# EasyEDA Pro project STM32功能模块V2.epro, schematic STM32功能模块V2-5V-GND互换
Board Name: STM32功能模块; Create Date: 2025-04-14; Page Name: P1; Project Name: STM32功能模块; Schematic Name: STM32功能模块; Update Date: 2025-08-05; Company: 嘉立创EDA; Page Size: A4; Version: V1.0
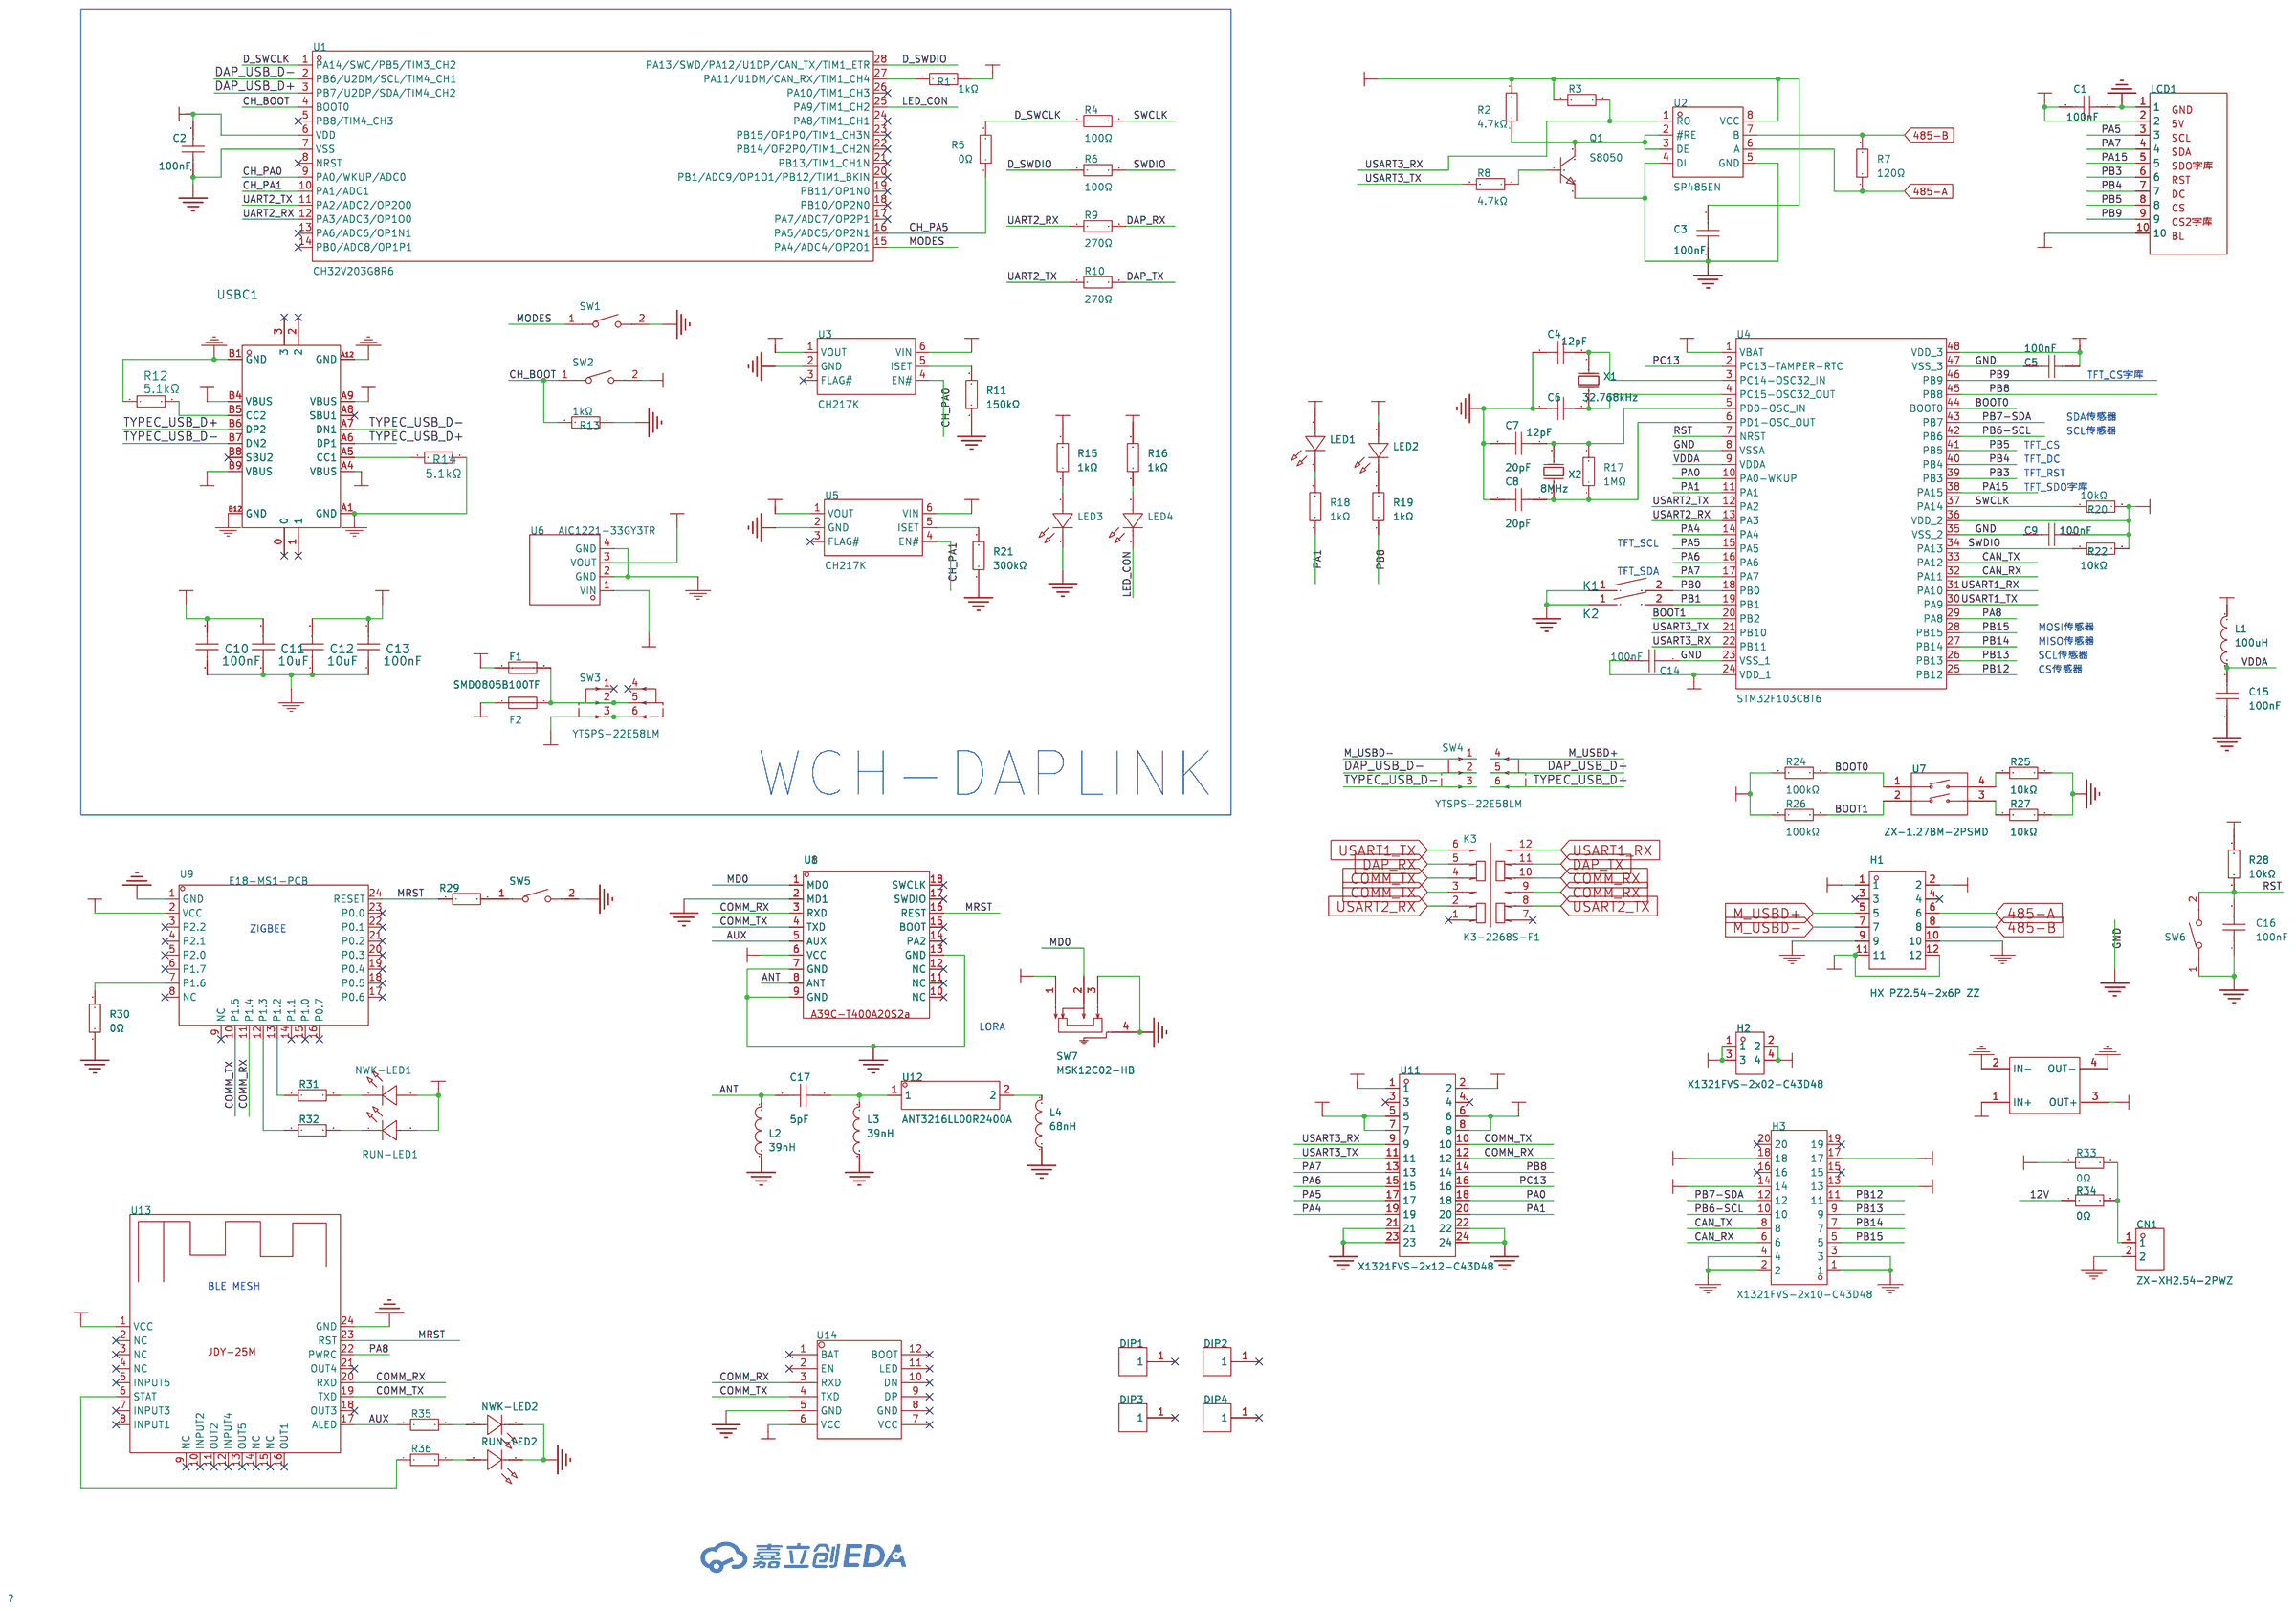
[diagram p0: schematic sheet]

## Parts
C1  100nF  [C0603]
C2  100nF  [C0603]
C3  100nF  [C0603]
C4  12pF  [C0603]
C5  100nF  [C0603]
C6  12pF  [C0603]
C7  20pF  [C0603]
C8  20pF  [C0603]
C9  100nF  [C0603]
C10  100nF  [C0603]
C11  10uF  [C0805]
C12  10uF  [C0805]
C13  100nF  [C0603]
C14  100nF  [C0603]
C15  100nF  [C0603]
C16  100nF  [C0603]
C17  5pF  [C0603]
CN1  ZX-XH2.54-2PWZ  [CONN-TH_2P-P2.50_ZX-XH2.54-2PWZ]
DIP1  -  [贴片铜柱M3*6+1]
DIP2  -  [贴片铜柱M3*6+1]
DIP3  -  [贴片铜柱M3*6+1]
DIP4  -  [贴片铜柱M3*6+1]
F1  SMD0805B100TF  [F0805]
F2  SMD0805B100TF  [F0805]
H1  HX PZ2.54-2x6P ZZ  [HDR-TH_12P-P2.54-V-M-R2-C6-S2.54_77313-101-12LF]
H2  X1321FVS-2x02-C43D48  [HDR-SMD_4P-P1.27-V-F-R2-C2-LS4.8]
H3  X1321FVS-2x10-C43D48  [HDR-SMD_20P-P1.27-V-F-R2-C10-LS4.8]
K1  TS665WS  [SW-SMD_L6.0-W6.0-LS6.6]
K2  TS665WS  [SW-SMD_L6.0-W6.0-LS6.6]
K3  5.1kΩ  [SW-TH_K3-2268S-F1]
L1  100uH  [L0805]
L2  39nH  [L0603]
L3  39nH  [L0603]
L4  68nH  [L0603]
LCD1  -  [1.54寸带字库液晶屏]
LED1  XL-1608UBC-04  [LED0603-RD_BLUE]
LED2  XL-1608UBC-04  [LED0603-RD_BLUE]
LED3  XL-1608UBC-04  [LED0603-RD_BLUE]
LED4  XL-1608UBC-04  [LED0603-RD_BLUE]
NWK-LED1  XL-1608UBC-04  [LED0603-RD_BLUE]
NWK-LED2  XL-1608UBC-04  [LED0603-RD_BLUE]
Q1  S8050  [SOT-23-3_L2.9-W1.3-P1.90-LS2.4-BR]
R1  1kΩ  [R0603]
R2  4.7kΩ  [R0603]
R3  4.7kΩ  [R0603]
R4  100Ω  [R0603]
R5  0Ω  [R0603]
R6  100Ω  [R0603]
R7  120Ω  [R1206]
R8  4.7kΩ  [R0603]
R9  270Ω  [R0603]
R10  270Ω  [R0603]
R11  150kΩ  [R0603]
R12  5.1kΩ  [R0603]
R13  1kΩ  [R0603]
R14  5.1kΩ  [R0603]
R15  1kΩ  [R0603]
R16  1kΩ  [R0603]
R17  1MΩ  [R0603]
R18  1kΩ  [R0603]
R19  1kΩ  [R0603]
R20  10kΩ  [R0603]
R21  300kΩ  [R0603]
R22  10kΩ  [R0603]
R24  100kΩ  [R0603]
R25  10kΩ  [R0603]
R26  100kΩ  [R0603]
R27  10kΩ  [R0603]
R28  10kΩ  [R0603]
R29  10kΩ  [R0603]
R30  0Ω  [R0603]
R31  1kΩ  [R0603]
R32  1kΩ  [R0603]
R33  0Ω  [R0603]
R34  0Ω  [R0603]
R35  1kΩ  [R0603]
R36  1kΩ  [R0603]
RUN-LED1  XL-1608UBC-04  [LED0603-RD_BLUE]
RUN-LED2  XL-1608UBC-04  [LED0603-RD_BLUE]
SW1  TS-1088-AR02016  [SW-SMD_L3.9-W3.0-P4.45]
SW2  TS-1088-AR02016  [SW-SMD_L3.9-W3.0-P4.45]
SW3  YTSPS-22E58LM  [SW-SMD_6P-L5.8-W5.8-P2.00-LS8.0_YTSPS-22E58LM]
SW4  YTSPS-22E58LM  [SW-SMD_6P-L5.8-W5.8-P2.00-LS8.0_YTSPS-22E58LM]
SW5  TS-1088-AR02016  [SW-SMD_L3.9-W3.0-P4.45]
SW6  TS-1088-AR02016  [SW-SMD_L3.9-W3.0-P4.45]
SW7  MSK12C02-HB  [SW-TH_MSK12C02-HB-1]
U1  CH32V203G8R6  [QSOP-28_L9.9-W3.9-P0.64-LS6.0-BL]
U2  SP485EN  [SOP-8_L5.0-W4.0-P1.27-LS6.0-BL]
U3  CH217K  [SOT-23-6_L2.9-W1.6-P0.95-LS2.8-BL]
U4  STM32F103C8T6  [LQFP-48_L7.0-W7.0-P0.50-LS9.0-BL]
U5  CH217K  [SOT-23-6_L2.9-W1.6-P0.95-LS2.8-BL]
U6  AIC1221-33GY3TR  [SOT-223_L6.5-W3.5-P2.30-LS7.0-BR]
U7  ZX-1.27BM-2PSMD  [SW-SMD_2P-L5.4-W4.1-P1.27-LS8.4]
U8  -  [Lora小模块]
U9  E18-MS1-PCB  [WIRELM-SMD_E18-MS1-PCB]
U10  -  [DC-DCmini]
U11  X1321FVS-2x12-C43D48  [HDR-SMD_24P-P1.27-V-F-R2-C12-LS4.8]
U12  ANT3216LL00R2400A  [ANT-SMD_L3.2-W1.6]
U13  -  [JDY-25M蓝牙模块]
U14  -  [度云4G模块]
USBC1  TYPE-C-31-M-12  [USB-C_SMD-TYPE-C-31-M-12]
X1  32.768kHz  [CRYSTAL-SMD_L3.2-W1.5-1]
X2  8MHz  [CRYSTAL-SMD_L5.0-W3.2]

## Library data of the parts
C1-C3 C5 C9 C10 C13-C16 = CC0603KRX7R9BB104: 容值:100nF;精度:±10%;额定电压:50V;材质(温度系数):X7R;; LCSC Part Name: 100nF ±10% 50V; Supplier Part: C14663; Manufacturer: YAGEO(国巨); Supplier Footprint: 0603; JLCPCB Part Class: 基础库; Datasheet: https://atta.szlcsc.com/upload/public/pdf/source/20180910/C282072_33301C7F631E79921B82A8DAC6BCC5B3.pdf; Supplier: LCSC; Tolerance: ±10%; Voltage Rated: 50V; Temperature Coefficient: X7R
C4 C6 = CC0603FRNPO9BN120: 容值:12pF;精度:±1%;额定电压:50V;材质(温度系数):NP0;; LCSC Part Name: 12pF ±1% 50V; Supplier Part: C519482; Manufacturer: YAGEO(国巨); Supplier Footprint: 0603; JLCPCB Part Class: 扩展库; Datasheet: https://atta.szlcsc.com/upload/public/pdf/source/20200423/C519482_89049CE53433C44DEC6365B4D6A7EBAA.pdf; Supplier: LCSC; Tolerance: ±1%; Voltage Rated: 50V; Temperature Coefficient: NP0
C7 C8 = CC0603FRNPO9BN200: 容值:20pF;精度:±1%;额定电压:50V;材质(温度系数):NP0;; LCSC Part Name: 20pF ±1% 50V; Supplier Part: C326779; Manufacturer: YAGEO(国巨); Supplier Footprint: 0603; JLCPCB Part Class: 扩展库; Datasheet: https://atta.szlcsc.com/upload/public/pdf/source/20181031/C326779_4C607DD48C96BB53EFC11FE773ED8662.pdf; Supplier: LCSC; Tolerance: ±1%; Voltage Rated: 50V; Temperature Coefficient: NP0
C11 C12 = CL21A106KAYNNNE_C15850: 容值:10uF;精度:±10%;额定电压:25V;材质(温度系数):X5R;; LCSC Part Name: 10uF ±10% 25V; Supplier Part: C15850; Manufacturer: SAMSUNG(三星); Manufacturer Part: CL21A106KAYNNNE; Supplier Footprint: 0805; JLCPCB Part Class: Basic Part; Datasheet: https://atta.szlcsc.com/upload/public/pdf/source/20160103/1457707679302.pdf; Supplier: LCSC; Tolerance: ±10%; Voltage Rated: 25V; Temperature Coefficient: X5R
C17 = CC0603BRNPO9BN5R0: 容值:5pF;额定电压:50V;材质(温度系数):NP0;; LCSC Part Name: 5pF 50V ±0.1pF; Supplier Part: C519109; Manufacturer: YAGEO(国巨); Supplier Footprint: 0603; JLCPCB Part Class: 扩展库; Datasheet: https://atta.szlcsc.com/upload/public/pdf/source/20200423/C519109_C612DEB22678B486DFBC1FD411A90853.pdf; Supplier: LCSC; Voltage Rated: 50V; Temperature Coefficient: NP0
CN1 = ZX-XH2.54-2PWZ: 插针结构:1x2P;间距:2.5mm;安装方式:弯插;参考系列:XH;总PIN数:2P;排数:1;每排PIN数:2;行距:-;额定电流:3A;触头材质:黄铜;触头镀层:锡;工作温度范围:-25℃~+85℃;; LCSC Part Name: 1x2P 间距:2.5mm 弯插 系列:XH; Supplier Part: C7429641; Manufacturer: Megastar(兆星); Supplier Footprint: 弯插,P=2.5mm; JLCPCB Part Class: 扩展库; Datasheet: https://atta.szlcsc.com/upload/public/pdf/source/20230619/56AE8F2E01CDFEAA97FC89B5ED558AB5.pdf; Supplier: LCSC; Pins Structure: 1x2P; Pitch: 2.5mm; Mounting Type: 弯插; Reference Series: XH; Number of Pins: 2P; Number of Rows: 1; Number of PINs Per Row: 2; Rated Current: 3A; Contact Material: 黄铜; Contact Plating: 锡; Operating Temperature: -25℃~+85℃; Rated Voltage (Max): 250V; Plastic Material: PA66; Flame Retardant Rating: UL94V-0; Color: 白色; Z-Height of the Board: 5.9mm; X-Length of Bottom Edge on Board (Spacing Line): 7.5mm; Y-Width of Bottom Edge on Board: 7.32mm
DIP1-DIP4 = 贴片铜柱M3*6+1
F1 F2 = SMD0805B050TF: 最大电压:6V;最大电流:100A;保持电流:500mA;跳闸电流:1A;最大动作时间:100ms;; LCSC Part Name: 6V 0.5A; Supplier Part: C269104; Manufacturer: Brightking(台湾君耀); Supplier Footprint: 0805; JLCPCB Part Class: Extended Part; Datasheet: https://atta.szlcsc.com/upload/public/pdf/source/20180814/C269104_466839A5DB65F6E723CA6A162ACE747B.pdf; Supplier: LCSC; Operating Voltage (Max): 6V; Current Rating (Max): 100A; Hold Current: 500mA; Trip Current: 1A; Maximum Time to Trip: 100ms
H1 = HX PZ2.54-2x6P ZZ: 插针结构:2x6P;间距:2.54mm;行距:2.54mm;圆针/方针:方针;安装类型:直插;排数:双排;总PIN位数:12P;额定电流:3A;额定电压:-;配合针长度:6mm;塑高:2.5mm;端接针长度:3mm;触头材质:黄铜;触头镀层:金;工作温度范围:-40℃~+105℃;颜色:黑色;; LCSC Part Name: 2x6P 间距:2.54mm 方针 直插; Supplier Part: C32713279; Manufacturer: hanxia(韩下); Supplier Footprint: 插件,P=2.54mm; JLCPCB Part Class: Extended Part; Datasheet: https://atta.szlcsc.com/upload/public/pdf/source/20240723/7CFD6BBE81D942E4FB6053E60626E655.pdf; Supplier: LCSC; Pin Structure: 2x6P; Pitch: 2.54mm; Row Spacing: 2.54mm; Circluar Pins/Square Pins: 方针; Mounting Type: 直插; Number of Rows: 双排; Number of Pins: 12P; Current Rating (Max): 3A; Length of Mating Pin: 6mm; Insulation Height: 2.5mm; Length of End Connection Pin: 3mm; Contact Material: 黄铜; Contact Plating: 金; Operating Temperature Range: -40℃~+105℃; Color: 黑色
H2 = X1321FVS-2x02-C43D48: 插孔结构:2x2P;间距:1.27mm;行距:-;圆孔/方孔:方孔;安装类型:立贴;排数:双排;总孔位数:4P;额定电流:1A;额定电压:250V;插孔方向:顶部;塑高:4.3mm;触头材质:黄铜;触头镀层:金;工作温度范围:-40℃~+105℃;焊接温度(最大值):260℃;; LCSC Part Name: 间距:1.27mm 2x2P 立贴; Supplier Part: C2684730; Manufacturer: XKB Connectivity(中国星坤); Supplier Footprint: SMD,P=1.27mm; JLCPCB Part Class: 扩展库; Datasheet: https://atta.szlcsc.com/upload/public/pdf/source/20211011/FC3020149D6BF5F353A6158A05565A46.pdf; Supplier: LCSC; Holes Structure: 2x2P; Pitch: 1.27mm; Circular Hole / Square Hole: 方孔; Mounting Type: 立贴; Number of Rows: 双排; Number of Holes: 4P; Current Rating (Max): 1A; Voltage Rating (Max): 250V; Holes Direction: 顶部; Insulation Height: 4.3mm; Contact Material: 黄铜; Contact Plating: 金; Operating Temperature Range: -40℃~+105℃; Soldering Temperature(Max): 260℃
H3 = X1321FVS-2x10-C43D48: 插孔结构:2x10P;间距:1.27mm;行距:-;圆孔/方孔:方孔;安装类型:立贴;排数:双排;总孔位数:20P;额定电流:1A;额定电压:250V;插孔方向:顶部;塑高:4.3mm;触头材质:黄铜;触头镀层:金;工作温度范围:-40℃~+105℃;焊接温度(最大值):260℃;; LCSC Part Name: 间距:1.27mm 2x10P 立贴; Supplier Part: C2684738; Manufacturer: XKB Connectivity(中国星坤); Supplier Footprint: SMD,P=1.27mm; JLCPCB Part Class: 扩展库; Datasheet: https://atta.szlcsc.com/upload/public/pdf/source/20211011/FC3020149D6BF5F353A6158A05565A46.pdf; Supplier: LCSC; Holes Structure: 2x10P; Pitch: 1.27mm; Circular Hole / Square Hole: 方孔; Mounting Type: 立贴; Number of Rows: 双排; Number of Holes: 20P; Current Rating (Max): 1A; Voltage Rating (Max): 250V; Holes Direction: 顶部; Insulation Height: 4.3mm; Contact Material: 黄铜; Contact Plating: 金; Operating Temperature Range: -40℃~+105℃; Soldering Temperature(Max): 260℃
K1 K2 = TS665WS_C398058: 触点电流:50mA;额定电压(DC):12V;电路结构:单刀单掷;安装方式:立贴;带灯:-;作用力:200gf@±50gf;机械寿命:-;; LCSC Part Name: 6*6*5mm 立贴 轻触开关 无声软胶; Supplier Part: C398058; Manufacturer: SHOU HAN(首韩); Supplier Footprint: SMD; JLCPCB Part Class: Extended Part; Datasheet: https://atta.szlcsc.com/upload/public/pdf/source/20190620/C398058_75EC11C2CCBC6DD113AE79D58CB25A40.pdf; Supplier: LCSC; Contact Current: 50mA; Voltage Rating (DC): 12V; Circuit: 单刀单掷; Mounting Style: 立贴; Actuator Style: 圆形按钮; Operating Force: 200gf@±50gf; Switch Length: 6mm; Switch Width: 6mm; Switch Height: 5mm; Insulation Resistance: 100MΩ; Actuator/Cap Color: 黑色; Operating Temperature: -25℃~+70℃; Pin Style: SMD接片; Strike Gundam: 否
K3 = K3-2268S-F1: 额定电流(DC):300mA;额定电压(DC):6V;额定电流(AC):-;额定电压(AC):-;电路结构:四刀双掷;安装方式:卧贴;机械寿命:1万次;开关颜色:黑色;; LCSC Part Name: 卧贴双档 滑动开关; Supplier Part: C223866; Manufacturer: 韩国韩荣; Supplier Footprint: SMD; JLCPCB Part Class: Extended Part; Datasheet: https://atta.szlcsc.com/upload/public/pdf/source/20210810/F3B8165E5EF761676C00BB7ABA008864.pdf; Supplier: LCSC; Current Rating (DC): 300mA; Voltage Rating (DC): 6V; Circuit: 四刀双掷; Mounting Style: 卧贴; Mechanical Life: 1万次; Actuator Color: 黑色; Actuator Style: 矩形柱状; Pin Style: 鸥翼型; Operating Temperature: -25℃~+80℃; Switch Length: 14.9mm; Switch Width: 3.5mm; Switch Height: 3.5mm; Tolerance: ±1%; Power(Watts): 100mW; Overload Voltage (Max): 75V; Temperature Coefficient: ±100ppm/℃; Type: 厚膜电阻; Operating Temperature Range: -55℃~+155℃
L1 = MLF2012C101KT000: 电感值:100uH;精度:±10%;额定电流:2mA;饱和电流(Isat):-;直流电阻(DCR):2.5Ω;; LCSC Part Name: 100uH ±10%; Supplier Part: C68035; Manufacturer: TDK; Supplier Footprint: 0805; JLCPCB Part Class: 扩展库; Datasheet: https://atta.szlcsc.com/upload/public/pdf/source/20160817/1471407089654.pdf; Supplier: LCSC; Tolerance: ±10%; Rated Current: 2mA; DC Resistance (DCR): 2.5Ω; Q @ Freq: 25@1MHz; Frequency - Self Resonant: 7MHz
L2 L3 = SDCL1608C39NJTDF: 电感值:39nH;精度:±5%;额定电流:300mA;饱和电流(Isat):-;直流电阻(DCR):700mΩ;; LCSC Part Name: 39nH ±5%; Supplier Part: C74308; Manufacturer: Sunlord(顺络); Supplier Footprint: 0603; JLCPCB Part Class: 扩展库; Datasheet: https://atta.szlcsc.com/upload/public/pdf/source/20231027/6126A3AAC5912C34388756BE22DEE00C.pdf; Supplier: LCSC; Tolerance: ±5%; Rated Current: 300mA; DC Resistance(DCR): 700mΩ; Q @ Frequency: 12@100MHz; Frequency - Self Resonant: 1.4GHz
L4 = SDCL1608C68NJTDF: 电感值:68nH;精度:±5%;额定电流:300mA;饱和电流(Isat):-;直流电阻(DCR):850mΩ;; LCSC Part Name: 68nH ±5%; Supplier Part: C13415; Manufacturer: Sunlord(顺络); Supplier Footprint: 0603; JLCPCB Part Class: 扩展库; Datasheet: https://atta.szlcsc.com/upload/public/pdf/source/20231027/6126A3AAC5912C34388756BE22DEE00C.pdf; Supplier: LCSC; Tolerance: ±5%; Rated Current: 300mA; DC Resistance(DCR): 850mΩ; Q @ Frequency: 12@100MHz; Frequency - Self Resonant: 900MHz
LCD1 = 1.54寸带字库液晶屏
LED1-LED4 = XL-1608UBC-04: 灯头类型:-;发光颜色:蓝色;正向压降(Vf):3.3V;功率:70mW;正向电流:20mA;波长:455nm~475nm;二极管配置:-;透镜颜色:无色透明透镜;色温:-;发光强度:300mcd;发光角度:120°;载带方式:正贴;工作温度:-20℃~+85℃;; Supplier Part: C965807; Manufacturer: XINGLIGHT(成兴光); Supplier Footprint: 0603; JLCPCB Part Class: 扩展库; Datasheet: https://atta.szlcsc.com/upload/public/pdf/source/20250213/9D28F40E58C3285D8CA3C7212E2FBA3B.pdf; Supplier: LCSC; Illumination Color: 蓝色; Voltage - Forward(Vf): 3.3V; Power(Watts): 70mW; Forward Current: 20mA; Wavelength - Dominant: 455nm~475nm; Peak Wavelength: 470nm; Lens Color: 无色透明透镜; Luminous Intensity: 300mcd; Viewing Angle: 120°; Mounting Sytle: 正贴; Operating Temperature: -20℃~+85℃
NWK-LED1 NWK-LED2 RUN-LED1 RUN-LED2 = XL-1608UBC-04: 灯头类型:-;发光颜色:蓝色;正向压降(Vf):3.3V;功率:70mW;正向电流:20mA;波长:455nm~475nm;二极管配置:-;透镜颜色:无色透明透镜;色温:-;发光强度:300mcd;发光角度:120°;载带方式:正贴;工作温度:-20℃~+85℃;; Supplier Part: C965807; Manufacturer: XINGLIGHT(成兴光); Supplier Footprint: 0603; JLCPCB Part Class: 扩展库; Datasheet: https://atta.szlcsc.com/upload/public/pdf/source/20250213/9D28F40E58C3285D8CA3C7212E2FBA3B.pdf; Supplier: LCSC; Illumination Color: 蓝色; Voltage - Forward(Vf): 3.3V; Power(Watts): 70mW; Forward Current: 20mA; Wavelength - Dominant: 455nm~475nm; Peak Wavelength: 470nm; Lens Color: 无色透明透镜; Luminous Intensity: 300mcd; Viewing Angle: 120°; Mounting Sytle: 正贴; Operating Temperature: -20℃~+85℃; Emitted Color: 蓝灯; Dominant Wavelength: 460nm~469nm; Power Dissipation: 80mW
Q1 = S8050_C2891804: 晶体管类型:NPN;集电极电流(Ic):500mA;集射极击穿电压(Vceo):25V;功率(Pd):300mW;直流电流增益(hFE@Ic,Vce):400@50mA,1V;; LCSC Part Name: NPN 电流:500mA 耐压:25V; Supplier Part: C2891804; Manufacturer: YONGYUTAI(永裕泰); Supplier Footprint: SOT-23; JLCPCB Part Class: 扩展库; Datasheet: https://atta.szlcsc.com/upload/public/pdf/source/20210901/5347316A10609C628D4D69AE01446E5B.pdf; Supplier: LCSC; Transistor Type: NPN; Collector Current (Ic): 500mA; Collector-Emitter Breakdown Voltage (Vceo): 25V; Power Dissipation (Pd): 300mW; DC Current Gain (hFE@Ic,Vce): 400@50mA,1V; Collector Cut-Off Current (Icbo): 1uA; Collector-Emitter Saturation Voltage (VCE(sat)@Ic,Ib): 500mV@500mA,50mA
R1 R13 R15 R16 R18 R19 R31 R32 R35 R36 = 0603WAF1001T5E: 电阻类型:厚膜电阻;阻值:1kΩ;精度:±1%;功率:100mW;最大工作电压:75V;温度系数:±100ppm/℃;; LCSC Part Name: 1kΩ ±1% 100mW 厚膜电阻; Supplier Part: C21190; Manufacturer: UNI-ROYAL(厚声); Supplier Footprint: 0603; JLCPCB Part Class: 基础库; Datasheet: https://atta.szlcsc.com/upload/public/pdf/source/20200306/C422600_1E6D84923E4A46A82E41ADD87F860B5C.pdf; Supplier: LCSC; Type: 厚膜电阻; Tolerance: ±1%; Power(Watts): 100mW; Overload Voltage (Max): 75V; Temperature Coefficient: ±100ppm/℃; Operating Temperature Range: -55℃~+155℃
R2 R3 R8 = 0603WAF4701T5E: 电阻类型:厚膜电阻;阻值:4.7kΩ;精度:±1%;功率:100mW;最大工作电压:75V;温度系数:±100ppm/℃;; LCSC Part Name: 4.7kΩ ±1% 100mW 厚膜电阻; Supplier Part: C23162; Manufacturer: UNI-ROYAL(厚声); Supplier Footprint: 0603; JLCPCB Part Class: 基础库; Datasheet: https://atta.szlcsc.com/upload/public/pdf/source/20200306/C422600_1E6D84923E4A46A82E41ADD87F860B5C.pdf; Supplier: LCSC; Type: 厚膜电阻; Tolerance: ±1%; Power(Watts): 100mW; Overload Voltage (Max): 75V; Temperature Coefficient: ±100ppm/℃; Operating Temperature Range: -55℃~+155℃
R4 R6 = 0603WAF1000T5E: 电阻类型:厚膜电阻;阻值:100Ω;精度:±1%;功率:100mW;最大工作电压:75V;温度系数:±200ppm/℃;; LCSC Part Name: 100Ω ±1% 100mW 厚膜电阻; Supplier Part: C22775; Manufacturer: UNI-ROYAL(厚声); Supplier Footprint: 0603; JLCPCB Part Class: 基础库; Datasheet: https://atta.szlcsc.com/upload/public/pdf/source/20200306/C422600_1E6D84923E4A46A82E41ADD87F860B5C.pdf; Supplier: LCSC; Type: 厚膜电阻; Tolerance: ±1%; Power(Watts): 100mW; Overload Voltage (Max): 75V; Temperature Coefficient: ±200ppm/℃; Operating Temperature Range: -55℃~+155℃
R5 R30 R33 R34 = 0603WAF0000T5E: 电阻类型:厚膜电阻;阻值:0Ω;精度:±1%;功率:100mW;最大工作电压:75V;; LCSC Part Name: 0Ω ±1% 100mW 厚膜电阻; Supplier Part: C21189; Manufacturer: UNI-ROYAL(厚声); Supplier Footprint: 0603; JLCPCB Part Class: 基础库; Datasheet: https://atta.szlcsc.com/upload/public/pdf/source/20200306/C422600_1E6D84923E4A46A82E41ADD87F860B5C.pdf; Supplier: LCSC; Type: 厚膜电阻; Tolerance: ±1%; Power(Watts): 100mW; Overload Voltage (Max): 75V; Operating Temperature Range: -55℃~+155℃
R7 = 1206W4J0121T5E: 电阻类型:厚膜电阻;阻值:120Ω;精度:±5%;功率:250mW;最大工作电压:200V;温度系数:±100ppm/℃;; LCSC Part Name: 120Ω ±5% 250mW 厚膜电阻; Supplier Part: C25351; Manufacturer: UNI-ROYAL(厚声); Supplier Footprint: 1206; JLCPCB Part Class: 扩展库; Datasheet: https://atta.szlcsc.com/upload/public/pdf/source/20200306/C422600_1E6D84923E4A46A82E41ADD87F860B5C.pdf; Supplier: LCSC; Type: 厚膜电阻; Tolerance: ±5%; Power(Watts): 250mW; Overload Voltage (Max): 200V; Temperature Coefficient: ±100ppm/℃; Operating Temperature Range: -55℃~+155℃
R9 R10 = 0603WAF2700T5E: 电阻类型:厚膜电阻;阻值:270Ω;精度:±1%;功率:100mW;最大工作电压:75V;温度系数:±100ppm/℃;; LCSC Part Name: 270Ω ±1% 100mW 厚膜电阻; Supplier Part: C22966; Manufacturer: UNI-ROYAL(厚声); Supplier Footprint: 0603; JLCPCB Part Class: 基础库; Datasheet: https://atta.szlcsc.com/upload/public/pdf/source/20200306/C422600_1E6D84923E4A46A82E41ADD87F860B5C.pdf; Supplier: LCSC; Type: 厚膜电阻; Tolerance: ±1%; Power(Watts): 100mW; Overload Voltage (Max): 75V; Temperature Coefficient: ±100ppm/℃; Operating Temperature Range: -55℃~+155℃
R11 = 0603WAF1503T5E: 电阻类型:厚膜电阻;阻值:150kΩ;精度:±1%;功率:100mW;最大工作电压:75V;温度系数:±100ppm/℃;; LCSC Part Name: 150kΩ ±1% 100mW 厚膜电阻; Supplier Part: C22807; Manufacturer: UNI-ROYAL(厚声); Supplier Footprint: 0603; JLCPCB Part Class: 基础库; Datasheet: https://atta.szlcsc.com/upload/public/pdf/source/20200306/C422600_1E6D84923E4A46A82E41ADD87F860B5C.pdf; Supplier: LCSC; Type: 厚膜电阻; Tolerance: ±1%; Power(Watts): 100mW; Overload Voltage (Max): 75V; Temperature Coefficient: ±100ppm/℃; Operating Temperature Range: -55℃~+155℃
R12 R14 = 0603WAF5101T5E: 阻值:5.1kΩ;精度:±1%;功率:100mW;温度系数:±100ppm/℃;电阻类型:厚膜电阻;; LCSC Part Name: 5.1kΩ ±1% 100mW 厚膜电阻; Supplier Part: C23186; Manufacturer: UNI-ROYAL(厚声); Supplier Footprint: 0603; JLCPCB Part Class: Basic Part; Datasheet: https://atta.szlcsc.com/upload/public/pdf/source/20200306/C422600_1E6D84923E4A46A82E41ADD87F860B5C.pdf; Supplier: LCSC; Tolerance: ±1%; Power(Watts): 100mW; Overload Voltage (Max): 75V; Temperature Coefficient: ±100ppm/℃; Type: 厚膜电阻; Operating Temperature Range: -55℃~+155℃
R17 = 0603WAF1004T5E: 电阻类型:厚膜电阻;阻值:1MΩ;精度:±1%;功率:100mW;最大工作电压:75V;温度系数:±100ppm/℃;; LCSC Part Name: 1MΩ ±1% 100mW 厚膜电阻; Supplier Part: C22935; Manufacturer: UNI-ROYAL(厚声); Supplier Footprint: 0603; JLCPCB Part Class: 基础库; Datasheet: https://atta.szlcsc.com/upload/public/pdf/source/20200306/C422600_1E6D84923E4A46A82E41ADD87F860B5C.pdf; Supplier: LCSC; Type: 厚膜电阻; Tolerance: ±1%; Power(Watts): 100mW; Overload Voltage (Max): 75V; Temperature Coefficient: ±100ppm/℃; Operating Temperature Range: -55℃~+155℃
R20 R22 R25 R27-R29 = 0603WAF1002T5E: 电阻类型:厚膜电阻;阻值:10kΩ;精度:±1%;功率:100mW;最大工作电压:75V;温度系数:±100ppm/℃;; LCSC Part Name: 厚膜电阻 10kΩ ±1% 100mW; Supplier Part: C25804; Manufacturer: UNI-ROYAL(厚声); Supplier Footprint: 0603; JLCPCB Part Class: 基础库; Datasheet: https://atta.szlcsc.com/upload/public/pdf/source/20200306/C422600_1E6D84923E4A46A82E41ADD87F860B5C.pdf; Supplier: LCSC; Type: 厚膜电阻; Tolerance: ±1%; Power(Watts): 100mW; Overload Voltage (Max): 75V; Temperature Coefficient: ±100ppm/℃; Operating Temperature Range: -55℃~+155℃
R21 = 0603WAF3003T5E: 电阻类型:厚膜电阻;阻值:300kΩ;精度:±1%;功率:100mW;最大工作电压:75V;温度系数:±100ppm/℃;; LCSC Part Name: 300kΩ ±1% 100mW 厚膜电阻; Supplier Part: C23024; Manufacturer: UNI-ROYAL(厚声); Supplier Footprint: 0603; JLCPCB Part Class: 基础库; Datasheet: https://atta.szlcsc.com/upload/public/pdf/source/20200306/C422600_1E6D84923E4A46A82E41ADD87F860B5C.pdf; Supplier: LCSC; Type: 厚膜电阻; Tolerance: ±1%; Power(Watts): 100mW; Overload Voltage (Max): 75V; Temperature Coefficient: ±100ppm/℃; Operating Temperature Range: -55℃~+155℃
R24 R26 = 0603WAF1003T5E: 电阻类型:厚膜电阻;阻值:100kΩ;精度:±1%;功率:100mW;最大工作电压:75V;温度系数:±100ppm/℃;; LCSC Part Name: 100kΩ ±1% 100mW 厚膜电阻; Supplier Part: C25803; Manufacturer: UNI-ROYAL(厚声); Supplier Footprint: 0603; JLCPCB Part Class: 基础库; Datasheet: https://atta.szlcsc.com/upload/public/pdf/source/20200306/C422600_1E6D84923E4A46A82E41ADD87F860B5C.pdf; Supplier: LCSC; Type: 厚膜电阻; Tolerance: ±1%; Power(Watts): 100mW; Overload Voltage (Max): 75V; Temperature Coefficient: ±100ppm/℃; Operating Temperature Range: -55℃~+155℃
SW1 SW2 SW5 SW6 = TS-1088-AR02016: 电路结构:单刀单掷;按钮形状:圆形按钮;作用力:160gf;安装方式:立贴;开关长度:4mm;开关宽度:3mm;开关高度:2mm;带支架:不带;触点电流:50mA;额定电压(DC):12V;绝缘电阻:100MΩ;机械寿命:10万次;; LCSC Part Name: 4*3*2mm 立贴 轻触开关; Supplier Part: C720477; Manufacturer: XUNPU(讯普); Supplier Footprint: SMD; JLCPCB Part Class: 扩展库; Datasheet: https://atta.szlcsc.com/upload/public/pdf/source/20200810/C720475_60D09DD6C54279ADDB2DC25100F1CC11.pdf; Supplier: LCSC; Circuit: 单刀单掷; Actuator Style: 圆形按钮; Operating Force: 160gf; Mounting Style: 立贴; Switch Length: 4mm; Switch Width: 3mm; Switch Height: 2mm; Strike Gundam: 不带; Contact Current: 50mA; Voltage Rating (DC): 12V; Insulation Resistance: 100MΩ; Actuator/Cap Color: 黑色; Pin Style: SMD接片; Mechanical Life: 10万次; Operating Temperature: -30℃~+80℃
SW3 SW4 = YTSPS-22E58LM: 电路结构:双刀双掷;自锁/无锁:自锁;安装方式:立贴;触点电流:500mA;额定电压 (DC):50V;作用力:1.8N;机械寿命:2万次;; LCSC Part Name: 5.8x5.8mm 贴片按键开关; Supplier Part: C2941005; Manufacturer: YIYUAN(怡远); Supplier Footprint: SMD; JLCPCB Part Class: 扩展库; Datasheet: https://atta.szlcsc.com/upload/public/pdf/source/20220105/5C885D3D6FAB3BC8492E6C715FEB9C6C.pdf; Supplier: LCSC; Circuit: 双刀双掷; Self Lock / No Lock: 自锁; Actuator Style: 方形柱塞; Mounting Style: 立贴; Contact Current: 500mA; Voltage Rating (DC): 50V; Insulation Resistance: 1000MΩ; Actuator/Cap Color: 白色; Pin Style: PC引脚; Operating Force: 1.8N; Operating Temperature: -40℃~+85℃; Mechanical Life: 2万次
SW7 = MSK12C02-HB: LCSC Part Name: 两档侧拨贴片 7脚拨动 黑柄,柄长1.5mm,带定位柱; Supplier Part: C431541; Manufacturer: SHOU HAN(首韩); Supplier Footprint: SMD; JLCPCB Part Class: Extended Part; Datasheet: https://atta.szlcsc.com/upload/public/pdf/source/20190925/C431541_43A76A06FD86AD8E3069A6BFECE3ABC5.pdf; Supplier: LCSC
U1 = CH32V203G8R6: Supplier Part: C5200779; Manufacturer: WCH(南京沁恒); Supplier Footprint: QSOP-28; JLCPCB Part Class: 扩展库; Datasheet: https://atta.szlcsc.com/upload/public/pdf/source/20230523/1B381532B53560847D0152FAE396CF1C.pdf; Supplier: LCSC
U2 = SP485EN: 类型:收发器;数据速率:2.5Mbps;驱动器/接收器:1/1;; Supplier Part: C668207; Manufacturer: UMW(友台半导体); Supplier Footprint: SOP-8; JLCPCB Part Class: 扩展库; Datasheet: https://atta.szlcsc.com/upload/public/pdf/source/20231109/64D7A7C8CFF8EB522C7335F8DA8DF010.pdf; Supplier: LCSC; Types: 收发器; Supply Voltage: 4.75V~5.25V; Data Rate: 2.5Mbps; Driver/receiver: 1/1; Operating Temperature: 0℃~+70℃
U3 U5 = CH217K: 类型:负载开关;通道数:1;输入控制逻辑:低电平有效;输出电流:2.7A;工作电压:2.7V~5.5V;导通电阻:70mΩ;; LCSC Part Name: USB 限流配电开关芯片; Supplier Part: C7462749; Manufacturer: WCH(南京沁恒); Supplier Footprint: SOT-23-6; JLCPCB Part Class: 扩展库; Datasheet: https://atta.szlcsc.com/upload/public/pdf/source/20240614/C0960F2CAA1F151A0DBC53501BDEDFC6.pdf; Supplier: LCSC; Type: 负载开关; Number of Channels: 1; Control Input Logic: 低电平有效; Output Current: 2.7A; Voltage - Supply: 2.7V~5.5V; RDS(on): 70mΩ; Operating Temperature	-: -40℃~+85℃
U4 = STM32F103C8T6: CPU内核:ARM-M3;CPU最大主频:72MHz;应用领域:-;; LCSC Part Name: 主流增强型ARM Cortex-M3 MCU，具有64 KB Flash、72 MHz CPU、电机控制、USB和CAN; Supplier Part: C8734; Manufacturer: ST(意法半导体); Supplier Footprint: LQFP-48(7x7); JLCPCB Part Class: 扩展库; Datasheet: https://atta.szlcsc.com/upload/public/pdf/source/20220812/8363ACEC51AD55ECEB84799464F7CB85.pdf; Supplier: LCSC; CPU Core: ARM-M3; CPU Maximum Speed: 72MHz; Program Storage Size: 64KB; Program Memory Type: FLASH; Number of I/O: 37; ADC (Bit): 12bit; Low Voltage Detection Threshold: 2V~3.6V
U6 = AIC1221-33GY3TR: 输出类型:固定;输出极性:正;最大输入电压:6V;输出电压:3.3V;输出电流:2A;电源纹波抑制比(PSRR):70dB@(1kHz);; Supplier Part: C211622; Manufacturer: AIC(沛亨半导体); Supplier Footprint: SOT-223; JLCPCB Part Class: 扩展库; Datasheet: https://atta.szlcsc.com/upload/public/pdf/source/20180412/C211622_EA532406C6A2C276C2B2012B0B841276.pdf; Supplier: LCSC; Output Type: 固定; Output Polarity: 正; Number of Outputs: 1; Maximum Input Voltage: 6V; Output Voltage: 3.3V; Dropout Voltage: 700mV@(2A); Output Current: 2A; Power Supply Rejection Ratio (PSRR): 70dB@(1kHz)
U7 = ZX-1.27BM-2PSMD: 类型:平拨,凹槽式;电路结构:单刀单掷;开关位数:2位;额定电流:25mA;额定电压:24V;使用寿命:3千次;颜色:黑色;; LCSC Part Name: 间距1.27mm 平拨,凹槽式 2位拨码开关; Supplier Part: C7462922; Manufacturer: Megastar(兆星); Supplier Footprint: SMD-4P,4.1x5.4mm; JLCPCB Part Class: 扩展库; Datasheet: https://atta.szlcsc.com/upload/public/pdf/source/20231012/60E7F445862B8AF86BF5174C6B4E0EC9.pdf; Supplier: LCSC; Type: 平拨,凹槽式; Circuit: 单刀单掷; Number of Positions: 2位; Pin Style: 鸥翼型; Lead Pitch: 1.27mm; Current Rating: 25mA; Voltage Rating: 24V; Operating Temperature: -30℃~+85℃; Operating Life: 3千次; Color: 黑色
U8 = lora小模块
U9 = E18-MS1-PCB: 发射功率:4dBm;核心芯片:CC2530;支持接口:-;传输距离:200m;接收灵敏度:-97dBm;; Supplier Part: C97344; Manufacturer: EBYTE(亿佰特); Supplier Footprint: SMD,14x23mm; JLCPCB Part Class: 扩展库; Datasheet: https://atta.szlcsc.com/upload/public/pdf/source/20170306/1488794688117.pdf; Supplier: LCSC; Output Power: 4dBm; Core IC: CC2530; Antenna Type: PCB; Receive  Current: 27mA; Send  Curren: 28mA; Transmission Distance: 200m; Sensitivity: -97dBm; Operating Temperature: -40℃~+125℃
U10 = DC-DC模块mini
U11 = X1321FVS-2x12-C43D48: 插孔结构:2x12P;间距:1.27mm;行距:-;圆孔/方孔:方孔;安装类型:立贴;排数:双排;总孔位数:24P;额定电流:1A;额定电压:250V;插孔方向:顶部;塑高:4.3mm;触头材质:黄铜;触头镀层:金;工作温度范围:-40℃~+105℃;焊接温度(最大值):260℃;; LCSC Part Name: 间距:1.27mm 2x12P 立贴; Supplier Part: C2881860; Manufacturer: XKB Connectivity(中国星坤); Supplier Footprint: SMD,P=1.27mm; JLCPCB Part Class: 扩展库; Datasheet: https://atta.szlcsc.com/upload/public/pdf/source/20211011/FC3020149D6BF5F353A6158A05565A46.pdf; Supplier: LCSC; Holes Structure: 2x12P; Pitch: 1.27mm; Circular Hole / Square Hole: 方孔; Mounting Type: 立贴; Number of Rows: 双排; Number of Holes: 24P; Current Rating (Max): 1A; Voltage Rating (Max): 250V; Holes Direction: 顶部; Insulation Height: 4.3mm; Contact Material: 黄铜; Contact Plating: 金; Operating Temperature Range: -40℃~+105℃; Soldering Temperature(Max): 260℃
U12 = ANT3216LL00R2400A: 天线类型:芯片天线;中心频点:2.45GHz;带宽:160MHz;峰值增益:5.05dBi;极化方式:线性;功率容量:1W;驻波比:-;; LCSC Part Name: 无线组件陶瓷芯片天线; Supplier Part: C293767; Manufacturer: YAGEO(国巨); Supplier Footprint: 1206; JLCPCB Part Class: 扩展库; Datasheet: https://atta.szlcsc.com/upload/public/pdf/source/20181012/C293767_CDE82A2F74DC82A94DB708CB53B68F23.pdf; Supplier: LCSC; Antenna Type: 芯片天线; Central Frequency: 2.45GHz; Bandwidth: 160MHz; Peak Gain: 5.05dBi; Polarization Type: 线性; Impedance: 50Ω; Power capacity: 1W; Operating Temperature: -40℃~+105℃
U13 = JDY-25M蓝牙模块
U14 = 度云4G模块
USBC1 = TYPE-C-31-M-12: 连接器类型:Type-C;标准:-;公母:母;安装方式:-;触点数量:16P;端口数量:1;额定电流 - 电源:5A;工作温度范围:-;; LCSC Part Name: Type-C 母; Supplier Part: C165948; Manufacturer: 韩国韩荣; Supplier Footprint: SMD; JLCPCB Part Class: 扩展库; Datasheet: https://atta.szlcsc.com/upload/public/pdf/source/20220525/466408E853115E789EDB0DDC29077C05.pdf; Supplier: LCSC; Connector Type: Type-C; Gender: 母; Number of Contacts: 16P; Number of Ports: 1; Current Rating - Power (Max): 5A
X1 = XKXGI-SUA-32.768K: 晶振类型:贴片晶振;频率:32.768kHz;常温频差:±20ppm;负载电容:12.5pF;频率稳定度:±30ppm;; LCSC Part Name: 32.768kHz ±20ppm 12.5pF; Supplier Part: C5213671; Manufacturer: YXC(扬兴晶振); Supplier Footprint: SMD3215-2P; JLCPCB Part Class: 扩展库; Datasheet: https://atta.szlcsc.com/upload/public/pdf/source/20240329/3A7650FD985DD0DE85694D3785AB4916.pdf; Supplier: LCSC; Type: 贴片晶振; Normal temperature Frequency Tolerance: ±20ppm; Load Capacitance: 12.5pF; Frequency Stability: ±30ppm; Operating Temperature: -40℃~+85℃
X2 = XG1EL89CSI-111YLC-8M: 晶振类型:贴片晶振;频率:8MHz;常温频差:±10ppm;负载电容:20pF;频率稳定度:±20ppm;; LCSC Part Name: 8MHz ±10ppm 20pF; Supplier Part: C5280575; Manufacturer: YXC(扬兴晶振); Supplier Footprint: SMD5032; JLCPCB Part Class: 扩展库; Datasheet: https://atta.szlcsc.com/upload/public/pdf/source/20240329/44922B0AF7B60E58E9B66993B6077277.pdf; Supplier: LCSC; Type: 贴片晶振; Normal temperature Frequency Tolerance: ±10ppm; Load Capacitance: 20pF; Frequency Stability: ±20ppm; Operating Temperature: -40℃~+85℃

## Nets
3.3V: C3.2 C5.1 C9.1 C14.2 H3.13 H3.14 L1.2 LCD1.10 LED1.2(A) LED2.2(A) NWK-LED1.2(A) R2.2 R3.1 R15.2 R20.2 R22.2 R24.1 R26.1 R28.2 RUN-LED1.2(A) SW7.1 U2.8(VCC) U4.1(VBAT) U4.24(VDD_1) U4.36(VDD_2) U4.48(VDD_3) U5.1(VOUT) U8.6(VCC) U9.2(VCC) U11.5 U11.6 U11.7 U11.8 U13.1(VCC)
3.3VIN: C2.2 C12.2 C13.2 R1.1 R16.2 SW2.2 U1.6(VDD) U5.6(VIN) U6.3(VOUT)
5V: C1.2 H3.17 H3.18 LCD1.2 R33.1 U3.1(VOUT) U10.3(OUT+) U11.1 U11.2 U14.6(VCC)
5VIN: C10.2 C11.2 SW3.3 SW3.6 U3.6(VIN) U6.1(VIN)
12V: H1.1 H1.2 H2.1 H2.2 H2.3 H2.4 R34.1 U10.1(IN+)
GND: C1.1 C2.1 C3.1 C4.1 C5.2 C6.1 C7.2 C8.2 C9.2 C10.1 C11.1 C12.1 C13.1 C14.1 C15.1 C16.1 CN1.2 H1.9 H1.10 H3.1 H3.2 H3.3 H3.4 K1.1 K2.1 L2.1 L3.1 L4.1 LCD1.1 LED3.1(K) NWK-LED2.1(K) Q1.2(E) R11.1 R12.1 R13.1 R14.2 R21.1 R25.2 R27.2 R30.1 RUN-LED2.1(K) SW1.2 SW5.2 SW6.1 SW7.3 SW7.4 U1.7(VSS) U2.4(DI) U2.5(GND) U3.2(GND) U4.8(VSSA) U4.23(VSS_1) U4.35(VSS_2) U4.47(VSS_3) U5.2(GND) U6.2(GND) U6.4(GND) U8.2(MD1) U8.7(GND) U8.9(GND) U8.13(GND) U9.1(GND) U10.2(IN-) U10.4(OUT-) U11.21 U11.22 U11.23 U11.24 U13.24(GND) U14.5(GND) USBC1.A1(GND) USBC1.A12(GND) USBC1.B1(GND) USBC1.B12(GND)
VBUS: F1.1 USBC1.A4(VBUS) USBC1.A9(VBUS) USBC1.B4(VBUS) USBC1.B9(VBUS)
VDDA: C15.2 L1.1 U4.9(VDDA)
485-A: H1.6 R7.1 U2.6(A)
485-B: H1.8 R7.2 U2.7(B)
ANT: C17.1 L2.2 U8.8(ANT)
AUX: R35.1 U8.5(AUX) U13.17(ALED)
BOOT0: R24.2 U4.44(BOOT0) U7.1
BOOT1: R26.2 U4.20(PB2) U7.2
CAN_RX: H3.6 U4.32(PA11)
CAN_TX: H3.8 U4.33(PA12)
CH_BOOT: R13.2 SW2.1 U1.4(BOOT0)
CH_PA0: U1.9(PA0/WKUP/ADC0) U3.4(EN#)
CH_PA1: U1.10(PA1/ADC1) U5.4(EN#)
CH_PA5: R5.1 U1.16(PA5/ADC5/OP2N1)
COMM_RX: K3.9 K3.10 U8.3(RXD) U9.11(P1.4) U11.12 U13.20(RXD) U14.3(RXD)
COMM_TX: K3.3 K3.4 U8.4(TXD) U9.10(P1.5) U11.10 U13.19(TXD) U14.4(TXD)
D_SWCLK: R4.1 R5.2 U1.1(PA14/SWC/PB5/TIM3_CH2)
D_SWDIO: R6.1 U1.28(PA13/SWD/PA12/U1DP/CAN_TX/TIM1_ETR)
DAP_RX: K3.5 R9.2
DAP_TX: K3.11 R10.2
DAP_USB_D+: SW4.5 U1.3(PB7/U2DP/SDA/TIM4_CH2)
DAP_USB_D-: SW4.2 U1.2(PB6/U2DM/SCL/TIM4_CH1)
LED_CON: LED4.1(K) U1.25(PA9/TIM1_CH2)
M_USBD+: H1.5 SW4.4
M_USBD-: H1.7 SW4.1
M_VCC: F2.1 H1.11 H1.12
MD0: SW7.2 U8.1(MD0)
MODES: SW1.1 U1.15(PA4/ADC4/OP2O1)
MRST: R29.1 U8.16(REST) U9.24(RESET) U13.23(RST)
PA0: U4.10(PA0-WKUP) U11.18
PA1: R18.1 U4.11(PA1) U11.20
PA4: U4.14(PA4) U11.19
PA5: LCD1.3 U4.15(PA5) U11.17
PA6: U4.16(PA6) U11.15
PA7: LCD1.4 U4.17(PA7) U11.13
PA8: U4.29(PA8) U13.22(PWRC)
PA15: LCD1.5 U4.38(PA15)
PB0: K1.2 U4.18(PB0)
PB1: K2.2 U4.19(PB1)
PB3: LCD1.6 U4.39(PB3)
PB4: LCD1.7 U4.40(PB4)
PB5: LCD1.8 U4.41(PB5)
PB6-SCL: H3.10 U4.42(PB6)
PB7-SDA: H3.12 U4.43(PB7)
PB8: R19.1 U4.45(PB8) U11.14
PB9: LCD1.9 U4.46(PB9)
PB12: H3.11 U4.25(PB12)
PB13: H3.9 U4.26(PB13)
PB14: H3.7 U4.27(PB14)
PB15: H3.5 U4.28(PB15)
PC13: U4.2(PC13-TAMPER-RTC) U11.16
RST: C16.2 R28.1 SW6.2 U4.7(NRST)
SWCLK: R4.2 R20.1 U4.37(PA14)
SWDIO: R6.2 R22.1 U4.34(PA13)
TYPEC_USB_D+: SW4.6 USBC1.A6(DP1) USBC1.B6(DP2)
TYPEC_USB_D-: SW4.3 USBC1.A7(DN1) USBC1.B7(DN2)
UART2_RX: R9.1 U1.12(PA3/ADC3/OP1O0)
UART2_TX: R10.1 U1.11(PA2/ADC2/OP2O0)
USART1_RX: K3.12 U4.31(PA10)
USART1_TX: K3.6 U4.30(PA9)
USART2_RX: K3.2 U4.13(PA3)
USART2_TX: K3.8 U4.12(PA2)
USART3_RX: R3.2 U2.1(RO) U4.22(PB11) U11.9
USART3_TX: R8.2 U4.21(PB10) U11.11
$1N2016: R14.1 USBC1.A5(CC1)
$1N2017: R12.2 USBC1.B5(CC2)
$1N2291: R1.2 U1.27(PA11/U1DM/CAN_RX/TIM1_CH4)
$1N2650: R11.2 U3.5(ISET)
$1N2921: R21.2 U5.5(ISET)
$1N6135: C4.2 U4.3(PC14-OSC32_IN) X1.2(OSC2)
$1N6137: C6.2 U4.4(PC15-OSC32_OUT) X1.1(OSC1)
$1N6173: C7.1 R17.2 U4.5(PD0-OSC_IN) X2.2(OSC2)
$1N6209: C8.1 R17.1 U4.6(PD1-OSC_OUT) X2.1(OSC1)
$1N10422: F1.2 F2.2 SW3.2 SW3.5
$1N12578: R25.1 U7.4
$1N12582: R27.1 U7.3
$1N21945: Q1.3(C) R2.1 U2.2(#RE) U2.3(DE)
$1N21947: Q1.1(B) R8.1
$1N25766: R30.2 U9.7(P1.6)
$1N25771: NWK-LED1.1(K) R31.2
$1N25773: R32.2 RUN-LED1.1(K)
$1N25774: R31.1 U9.13(P1.2)
$1N25779: R32.1 U9.12(P1.3)
$1N25803: R29.2 SW5.1
$1N27492: R36.1 U13.6(STAT)
$1N27806: NWK-LED2.2(A) R35.2
$1N27810: R36.2 RUN-LED2.2(A)
$1N39568: C17.2 L3.2 U12.1
$1N39802: L4.2 U12.2
$1N58231: CN1.1 R33.2 R34.2
Net-(LED1-1): LED1.1(K) R18.2
Net-(LED2-1): LED2.1(K) R19.2
Net-(LED3-2): LED3.2(A) R15.1
Net-(LED4-2): LED4.2(A) R16.1

Not connected (* = marked no-connect by the designer): DIP1 1*; DIP2 1*; DIP3 1*; DIP4 1*; H1 3* 4*; H3 15* 16* 19* 20*; K3 1* 7*; SW3 1* 4*; U1 5(PB8/TIM4_CH3)* 8(NRST)* 13(PA6/ADC6/OP1N1)* 14(PB0/ADC8/OP1P1)* 17(PA7/ADC7/OP2P1)* 18(PB10/OP2N0)* 19(PB11/OP1N0)* 20(PB1/ADC9/OP1O1/PB12/TIM1_BKIN)* 21(PB13/TIM1_CH1N)* 22(PB14/OP2P0/TIM1_CH2N)* 23(PB15/OP1P0/TIM1_CH3N)* 24(PA8/TIM1_CH1)* 26(PA10/TIM1_CH3)*; U3 3(FLAG#)*; U5 3(FLAG#)*; U8 10(NC)* 11(NC)* 12(NC)* 14(PA2)* 15(BOOT)* 17(SWDIO)* 18(SWCLK)*; U9 3(P2.2)* 4(P2.1)* 5(P2.0)* 6(P1.7)* 8(NC)* 9(NC)* 14(P1.1)* 15(P1.0)* 16(P0.7)* 17(P0.6)* 18(P0.5)* 19(P0.4)* 20(P0.3)* 21(P0.2)* 22(P0.1)* 23(P0.0)*; U11 3* 4*; U13 2(NC)* 3(NC)* 4(NC)* 5(INPUT5)* 7(INPUT3)* 8(INPUT1)* 9(NC)* 10(INPUT2)* 11(OUT2)* 12(INPUT4)* 13(OUT5)* 14(NC)* 15(NC)* 16(OUT1)* 18(OUT3)* 21(OUT4)*; U14 1(BAT)* 2(EN)* 7(VCC)* 8(GND)* 9(DP)* 10(DN)* 11(LED)* 12(BOOT)*; USBC1 0* 1* 2* 3* A8(SBU1)* B8(SBU2)*

## Notes on the sheet
- TFT_CS字库
- SDA传感器
- SCL传感器
- TFT_CS
- TFT_DC
- TFT_RST
- TFT_SDO字库
- TFT_SCL
- TFT_SDA
- MOSI传感器
- MISO传感器
- SCL传感器
- CS传感器
- WCH-DAPLINK
- ZIGBEE
- LORA
- BLE MESH
